# EAGLE design blockoccdelay (EAGLE 9.6.2)
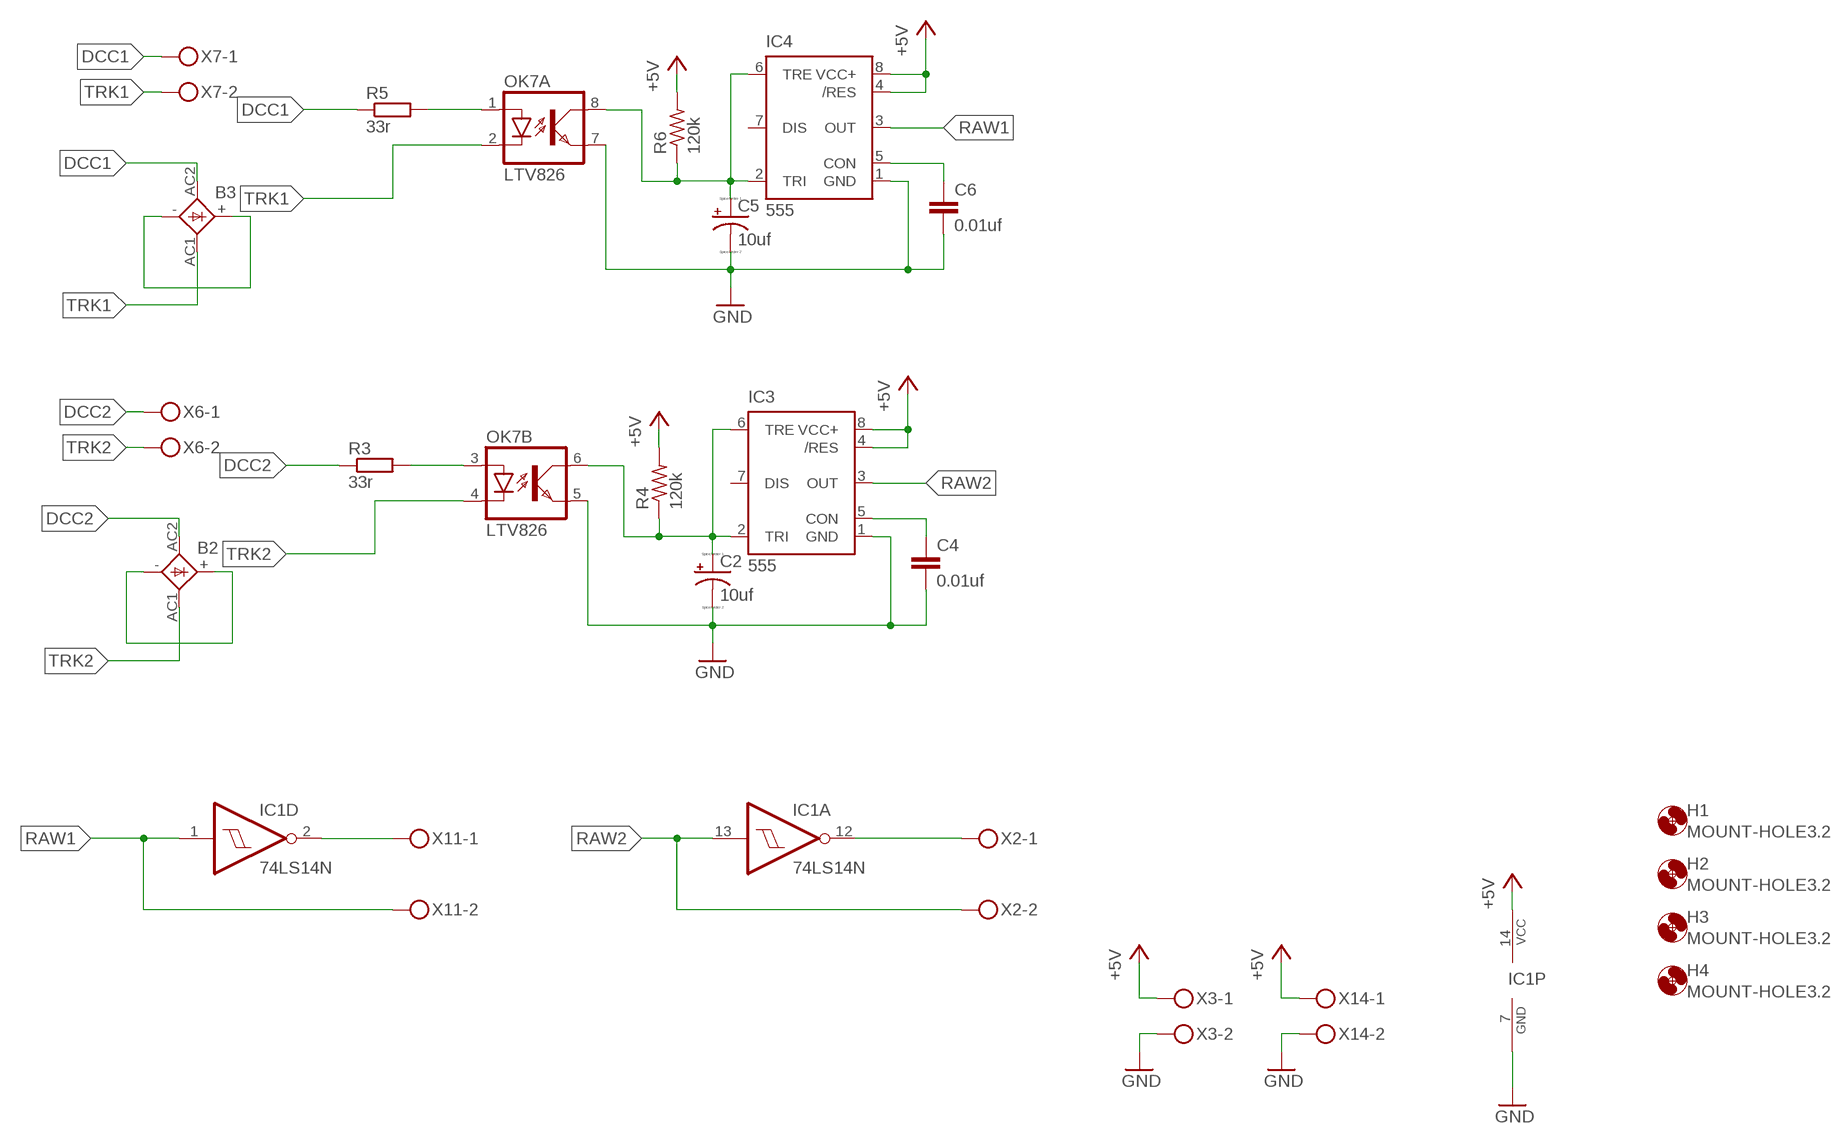
[diagram p0: schematic, sheet 1]

## Parts
B2  GBU4  [GBU4S]
B3  GBU4  [GBU4S]
C2  10uf  CPOL-USE2.5-6  [E2,5-6]
C4  0.01uf  C-EU050-035X075  [C050-035X075]
C5  10uf  CPOL-USE2.5-6  [E2,5-6]
C6  0.01uf  C-EU050-035X075  [C050-035X075]
H1  MOUNT-HOLE3.2  [3,2]
H2  MOUNT-HOLE3.2  [3,2]
H3  MOUNT-HOLE3.2  [3,2]
H4  MOUNT-HOLE3.2  [3,2]
IC1  74LS14N  [DIL14]
IC3  555  555P  [DIP08]
IC4  555  555P  [DIP08]
OK7  LTV826  [DIL08]
R3  33r  R-EU_0207/2V  [0207/2V]
R4  120k  R-US_0309/V  [0309V]
R5  33r  R-EU_0207/2V  [0207/2V]
R6  120k  R-US_0309/V  [0309V]
X2  MKDSN1,5/2-5,08  [MKDSN1,5/2-5,08]
X3  MKDSN1,5/2-5,08  [MKDSN1,5/2-5,08]
X6  MKDSN1,5/2-5,08  [MKDSN1,5/2-5,08]
X7  MKDSN1,5/2-5,08  [MKDSN1,5/2-5,08]
X11  MKDSN1,5/2-5,08  [MKDSN1,5/2-5,08]
X14  MKDSN1,5/2-5,08  [MKDSN1,5/2-5,08]

## Nets
+5V: IC1.14(P:VCC) IC3.4(/RES) IC3.8(VCC+) IC4.4(/RES) IC4.8(VCC+) R4.2 R6.2 X3.1 X14.1
DCC1: B3.AC2(AC1) R5.1 X7.1
DCC2: B2.AC2(AC1) R3.1 X6.1
GND: C2.- C4.2 C5.- C6.2 IC1.7(P:GND) IC3.1(GND) IC4.1(GND) OK7.5(B:EMIT) OK7.7(A:EMIT) X3.2 X14.2
N$4: IC1.12(A:O) X2.1
N$10: B2.+ B2.-
N$11: OK7.3(B:A) R3.2
N$12: C4.1 IC3.5(CON)
N$13: B3.+ B3.-
N$14: OK7.1(A:A) R5.2
N$15: C6.1 IC4.5(CON)
N$22: IC1.2(D:O) X11.1
RAW1: IC1.1(D:I) IC4.3(OUT) X11.2
RAW2: IC1.13(A:I) IC3.3(OUT) X2.2
TRI1: C2.+ IC3.2(TRI) IC3.6(TRE) OK7.6(B:COL) R4.1
TRI2: C5.+ IC4.2(TRI) IC4.6(TRE) OK7.8(A:COL) R6.1
TRK1: B3.AC1(AC2) OK7.2(A:C) X7.2
TRK2: B2.AC1(AC2) OK7.4(B:C) X6.2
Unconnected: IC1.3(E:I) IC1.4(E:O) IC1.5(F:I) IC1.6(F:O) IC1.8(C:O) IC1.9(C:I) IC1.10(B:O) IC1.11(B:I) IC3.7(DIS) IC4.7(DIS)

## Library data of the parts
B2 B3 = rectifier:GBU4: GENERAL INSTRUMENT RECTIFIER
C2 C5 = resistor:CPOL-US: POLARIZED CAPACITOR, American symbol
C4 C6 = resistor:C-EU: CAPACITOR, European symbol
H1-H4 = holes:MOUNT-HOLE: MOUNTING HOLE with drill center marker
IC1 = 74xx-us:74*14: Hex schmitt trigger INVERTER
IC3 IC4 = SparkFun-IC-Special-Function:555: General purpose bipolar Timer Datasheet <http://www.sparkfun.com/datasheets/Components/General/ne555.pdf> SparkFun Products SparkFun SparkPunk Sequencer Kit <https://www.sparkfun.com/products/12707> (KIT-12707) Storefront Component: 555 Timer <https://www.sparkfun.com/products/9273> (COM-09273) Two parts valid for production: VFP: IC-11930 (M7555 PTH) VFP: IC-09173 (555 PTH) - Preferred; PROD_ID: IC-09173; PROD_ID_ALT: IC-09173
OK7 = optocoupler:LTV826: OPTO COUPLER Source: LITEON, LTV816.pdf; OC_FARNELL: unknown; OC_NEWARK: unknown
R3 R5 = resistor:R-EU_: RESISTOR, European symbol
R4 R6 = resistor:R-US_: RESISTOR, American symbol
X2 X3 X6 X7 X11 X14 = con-phoenix-508:MKDSN1,5/2-5,08: MKDSN 1,5/ 2-5,08 Printklemme Nennstrom: 13,5 A Nennspannung: 250 V Rastermaß: 5,08 mm Polzahl: 2 Anschlussart: Schraubanschluss Montage: Löten Anschlussrichtung Leiter/Platine: 0 ° Artikelnummer: 1729128 Source: http://eshop.phoenixcontact.com .. 1729128.pdf

## Board
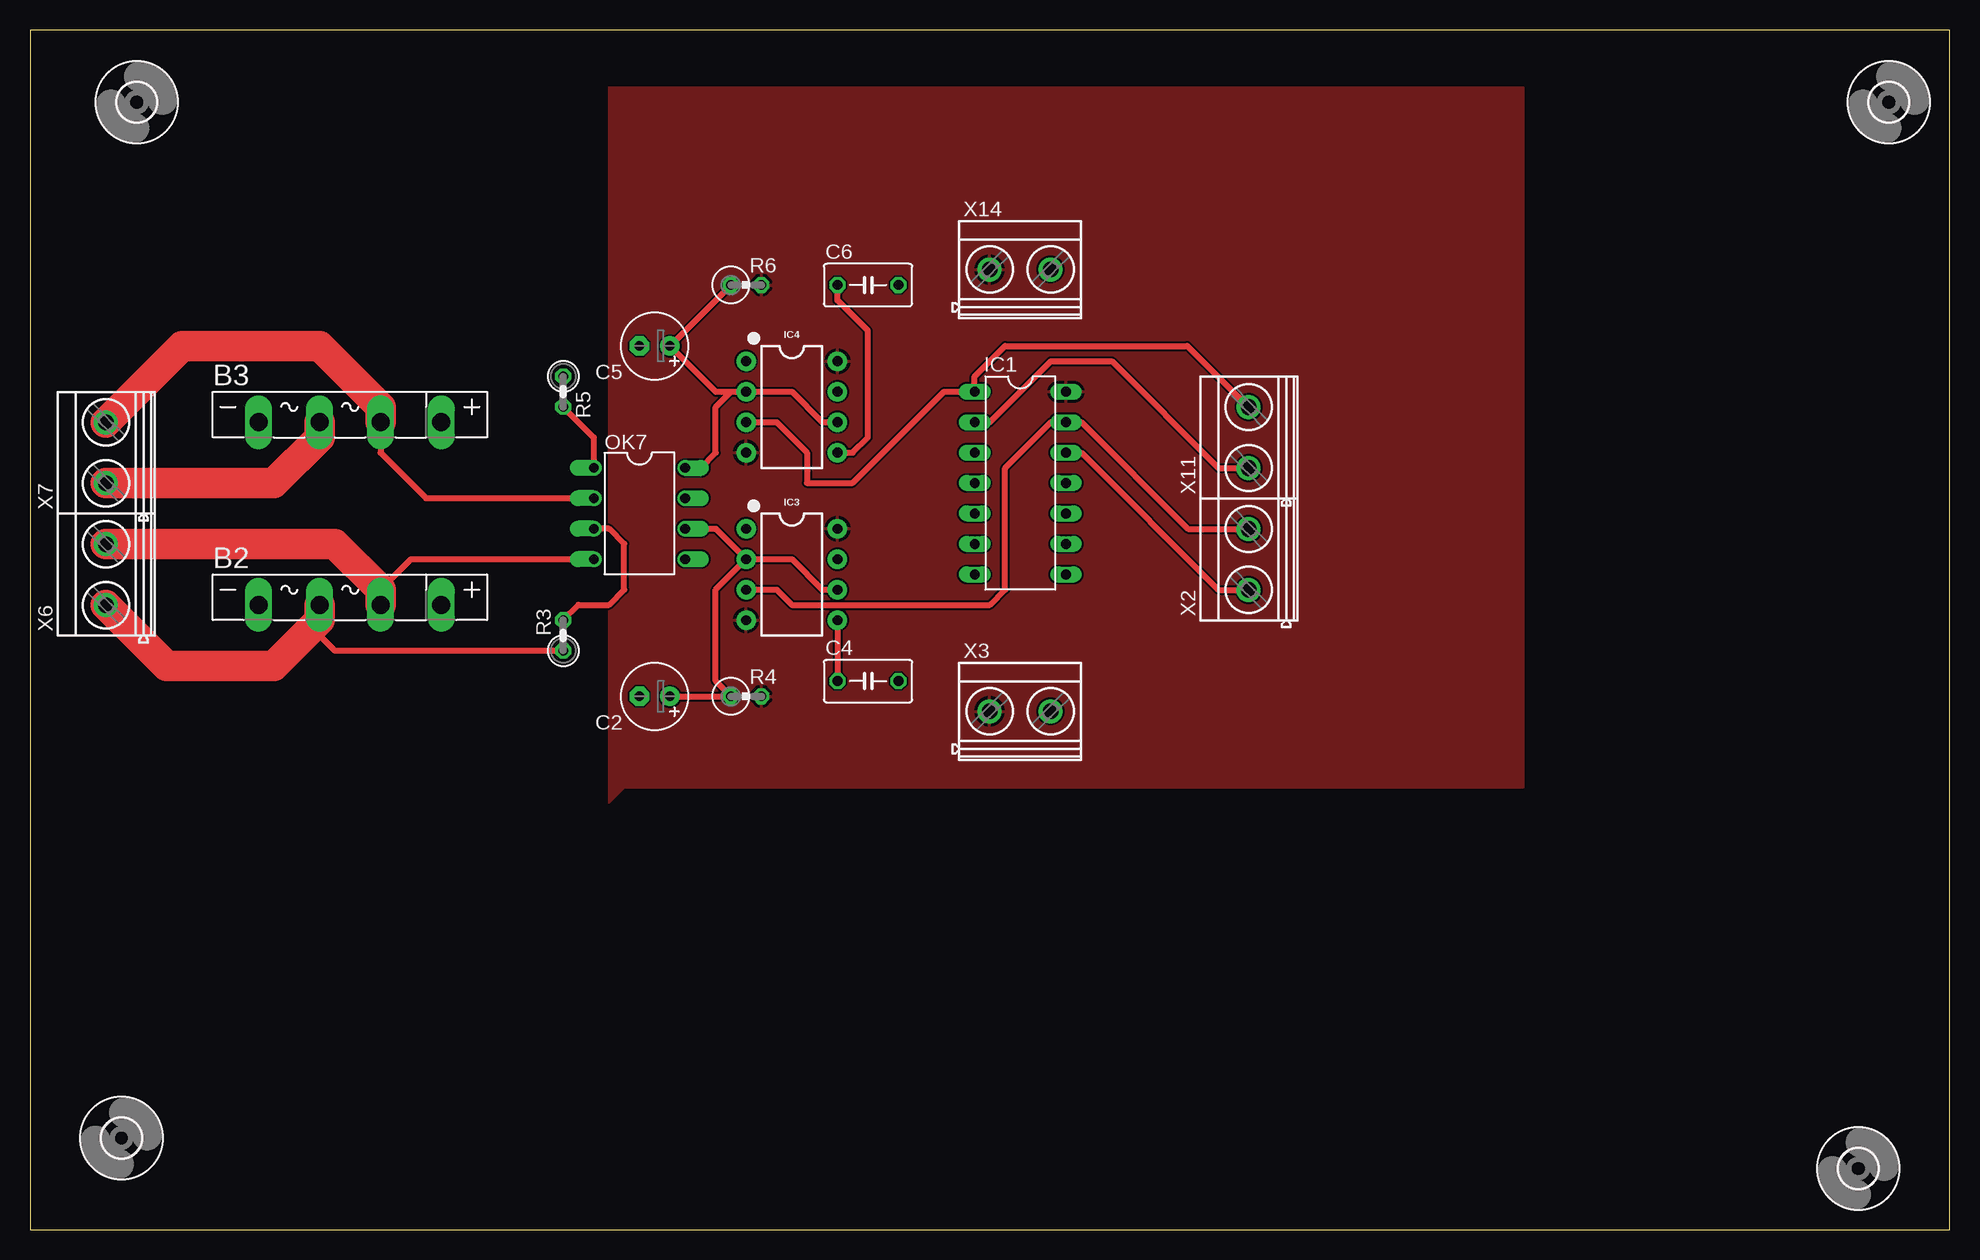
[diagram p1: board, top side]
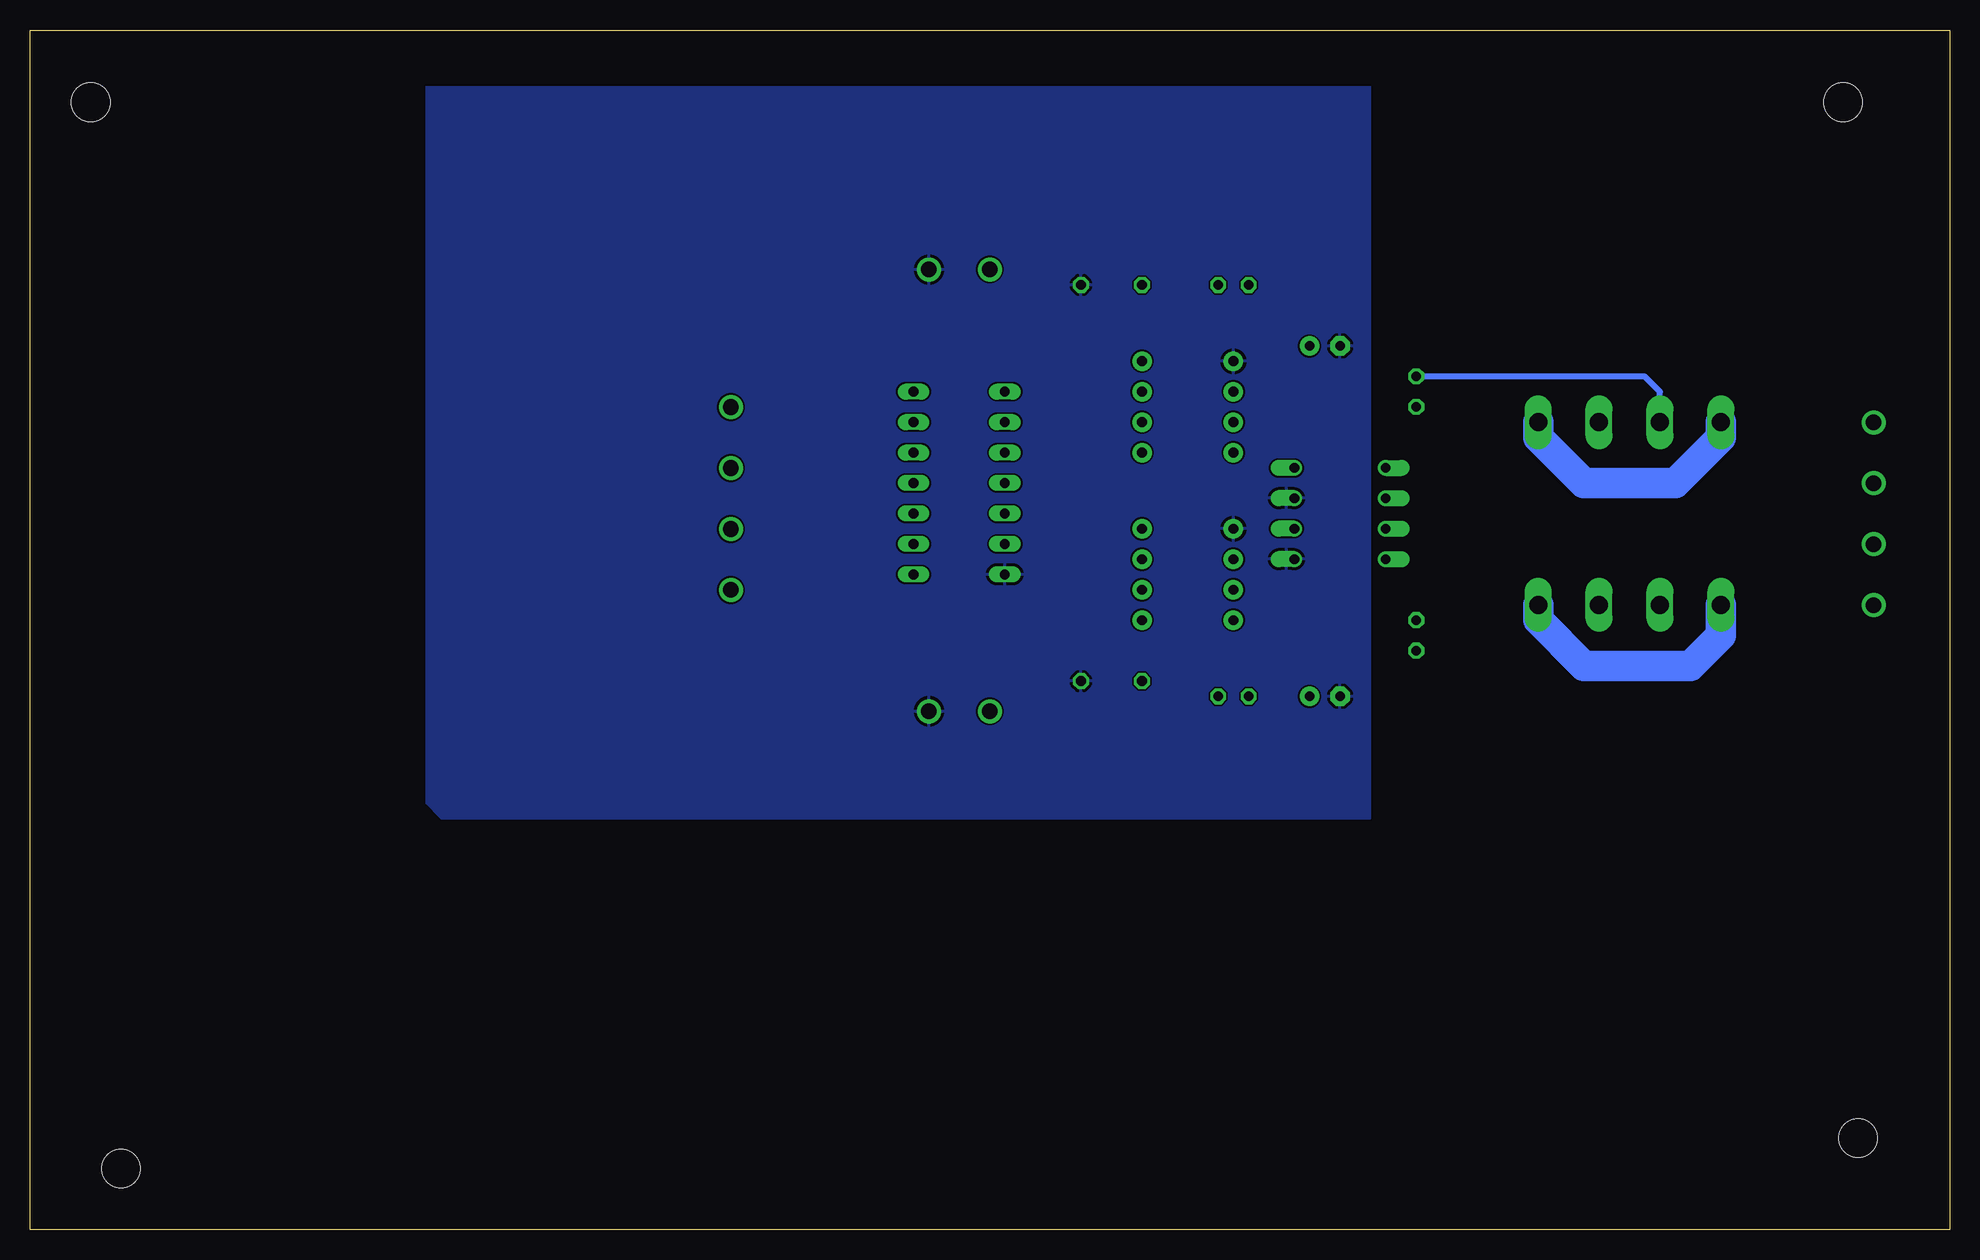
[diagram p2: board, bottom side, seen from below]

Size 160 x 100 mm. Coordinates in mm from the lower left corner, seen from the top.
Outline: 0,0 160,0 160,100 0,100 0,0
Copper layers (1*16): Top 0.035mm / dielectric 1.5mm / Bottom 0.035mm
Design rules "default": minimum track width 6mil, minimum drill 0.35mm, track to track 6mil, track to pad 6mil, pad to pad 6mil, via to via 6mil, smd to smd 6mil, copper to edge 40mil, drill to drill 6mil, minimum pad ring 10mil, minimum via ring 8mil, stop-mask expansion 4mil, vias tented up to drill 0mil, thermal gap 10mil

### Footprints (pad centres in the part's own frame; a part is rotated, then mirrored left to right if it is on the bottom)
GBU4S = drill 1.499 long: + 7.62,0; - -7.62,0; AC1 2.54,0; AC2 -2.54,0
E2,5-6 = drill 0.813 pad 1.6: + -1.27,0 | drill 0.813 pad 1.6 octagon: - 1.27,0
C050-035X075 = drill 0.813 octagon: 1 -2.54,0; 2 2.54,0
3,2 = hole 3.2: 0,0
DIL14 = drill 0.813 long: 1 -7.62,-3.81; 2 -5.08,-3.81; 3 -2.54,-3.81; 4 0,-3.81; 5 2.54,-3.81; 6 5.08,-3.81; 7 7.62,-3.81; 8 7.62,3.81; 9 5.08,3.81; 10 2.54,3.81; 11 0,3.81; 12 -2.54,3.81; 13 -5.08,3.81; 14 -7.62,3.81
DIP08 = drill 0.813 pad 1.626: 1 -3.81,-3.81; 2 -1.27,-3.81; 3 1.27,-3.81; 4 3.81,-3.81; 5 3.81,3.81; 6 1.27,3.81; 7 -1.27,3.81; 8 -3.81,3.81
DIL08 = drill 0.813 offset: 1 -3.81,-3.81; 2 -1.27,-3.81; 3 1.27,-3.81; 4 3.81,-3.81; 5 3.81,3.81; 6 1.27,3.81; 7 -1.27,3.81; 8 -3.81,3.81
0207/2V = drill 0.813 octagon: 1 -1.27,0; 2 1.27,0
0309V = drill 0.813 octagon: 1 -1.27,0; 2 1.27,0
MKDSN1,5/2-5,08 = drill 1.3 pad 2: 1 -2.561,0.025; 2 2.519,0.025

### Placement (x,y rotation side)
B2  26.67,52.07 0 top
B3  26.67,67.31 0 top
C2  52.07,44.45 180 top
C4  69.85,45.72 0 top
C5  52.07,73.66 180 top
C6  69.85,78.74 0 top
H1  7.62,7.62 0 top
H2  8.89,93.98 0 top
H3  154.94,93.98 0 top
H4  152.4,5.08 0 top
IC1  82.55,62.23 270 top
IC3  63.5,54.61 270 top
IC4  63.5,68.58 270 top
OK7  50.8,59.69 270 top
R3  44.45,49.53 90 top
R4  59.69,44.45 0 top
R5  44.45,69.85 270 top
R6  59.69,78.74 0 top
X2  101.6,55.88 90 top
X3  82.55,43.18 0 top
X6  6.35,54.61 90 top
X7  6.35,64.77 90 top
X11  101.6,66.04 90 top
X14  82.55,80.01 0 top

### Tracks (layer width: path | path; a pad name or v marks a point on that pad's centre or on a via)
+5V
  pour Top: 48.26,35.56 48.26,95.25 124.46,95.25 124.46,36.83 49.53,36.83
DCC1
  Top 2.54: X7.1 20.3,62.21 24.13,66.04 B3.AC2
  Bottom 0.508: R5.1 25.4,71.12 24.13,69.85 B3.AC2
DCC2
  Top 0.508: B2.AC2 24.13,49.53 25.4,48.26 R3.1
  Top 2.54: X6.1 11.38,46.99 20.32,46.99 24.13,50.8 B2.AC2
GND
  pour Bottom: 48.26,95.25 127,95.25 127,35.56 125.73,34.29 48.26,34.29
N$4
  Top 0.508: IC1.12 87.63,64.77 99.08,53.32 X2.1
N$10
  Bottom 2.54: B2.- 19.05,49.53 21.59,46.99 30.48,46.99 34.29,50.8 B2.+
N$11
  Top 0.508: R3.2 45.72,52.07 48.26,52.07 49.53,53.34 49.53,57.15 48.26,58.42 OK7.3
N$12
  Top 0.508: IC3.5 C4.1
N$13
  Bottom 2.54: B3.- 19.05,66.04 22.86,62.23 30.48,62.23 34.29,66.04 B3.+
N$14
  Top 0.508: R5.2 46.99,66.04 OK7.1
N$15
  Top 0.508: IC4.5 68.58,64.77 69.85,66.04 69.85,74.93 67.31,77.47 C6.1
N$22
  Top 0.508: IC1.2 80.01,67.31 85.09,72.39 90.17,72.39 99.08,63.48 X11.1
RAW1
  Top 0.508: X11.2 96.47,73.66 81.28,73.66 78.74,71.12 IC1.1 76.2,69.85 68.58,62.23 64.77,62.23 64.77,64.77 62.23,67.31 IC4.3
RAW2
  Top 0.508: X2.2 96.54,58.4 87.63,67.31 IC1.13 85.09,67.31 81.28,63.5 81.28,53.34 80.01,52.07 63.5,52.07 62.23,53.34 IC3.3
TRI1
  Top 0.508: IC3.2 63.5,55.88 66.04,53.34 IC3.6 | OK7.6 57.15,58.42 IC3.2 | IC3.2 57.15,53.34 57.15,45.72 R4.1 C2.+
TRI2
  Top 0.508: IC4.6 66.04,67.31 63.5,69.85 IC4.2 58.42,69.85 | OK7.8 55.88,63.5 57.15,64.77 57.15,68.58 58.42,69.85 | R6.1 C5.+ 57.15,69.85 58.42,69.85
TRK1
  Top 0.508: B3.AC1 29.21,64.77 33.02,60.96 OK7.2
  Top 2.54: X7.2 12.7,73.66 24.13,73.66 29.21,68.58 B3.AC1
TRK2
  Top 0.508: 29.21,53.34 31.75,55.88 OK7.4
  Top 2.54: X6.2 24.11,57.13 24.13,57.15 25.4,57.15 29.21,53.34 B2.AC1